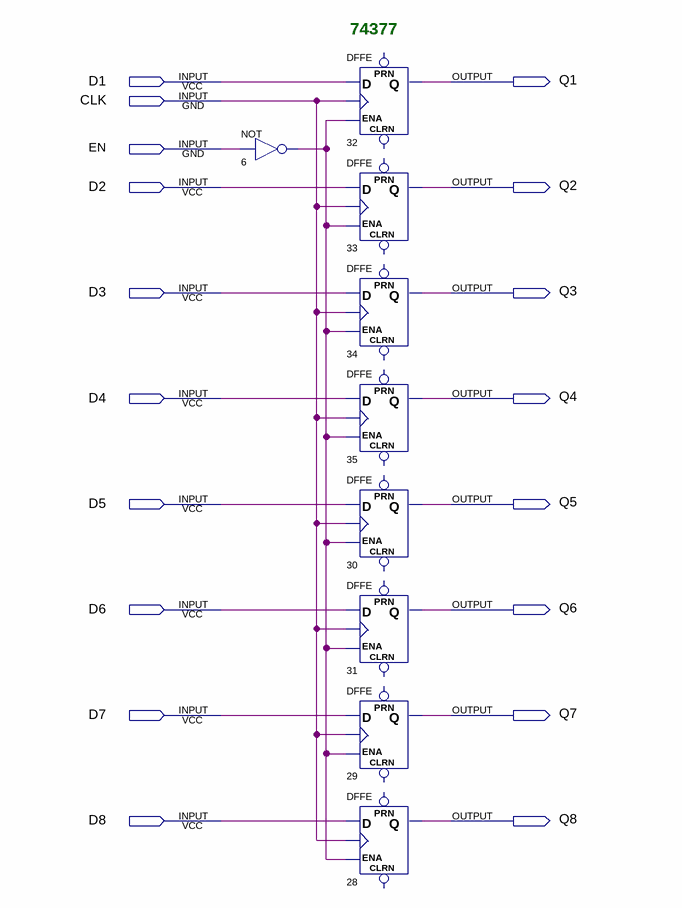
[diagram p0: schematic sheet]
// Quartus schematic 74377.bdf as structural Verilog: 9 symbols, 18 pins
module \74377  (
  input  D1,
  input  CLK,
  input  EN,
  input  D2,
  input  D3,
  input  D4,
  input  D5,
  input  D6,
  input  D7,
  input  D8,
  output Q1,
  output Q2,
  output Q3,
  output Q4,
  output Q5,
  output Q6,
  output Q7,
  output Q8
);

  wire n6_out;

  not u_6 (n6_out, EN);
  DFFE u_32 (.D(D1), .CLK(CLK), .ENA(n6_out), .Q(Q1));  // open: PRN, CLRN
  DFFE u_33 (.D(D2), .CLK(CLK), .ENA(n6_out), .Q(Q2));  // open: PRN, CLRN
  DFFE u_34 (.D(D3), .CLK(CLK), .ENA(n6_out), .Q(Q3));  // open: PRN, CLRN
  DFFE u_35 (.D(D4), .CLK(CLK), .ENA(n6_out), .Q(Q4));  // open: PRN, CLRN
  DFFE u_30 (.D(D5), .CLK(CLK), .ENA(n6_out), .Q(Q5));  // open: PRN, CLRN
  DFFE u_31 (.D(D6), .CLK(CLK), .ENA(n6_out), .Q(Q6));  // open: PRN, CLRN
  DFFE u_29 (.D(D7), .CLK(CLK), .ENA(n6_out), .Q(Q7));  // open: PRN, CLRN
  DFFE u_28 (.D(D8), .CLK(CLK), .ENA(n6_out), .Q(Q8));  // open: PRN, CLRN

  // Notes on the sheet:
  //   74377
endmodule
